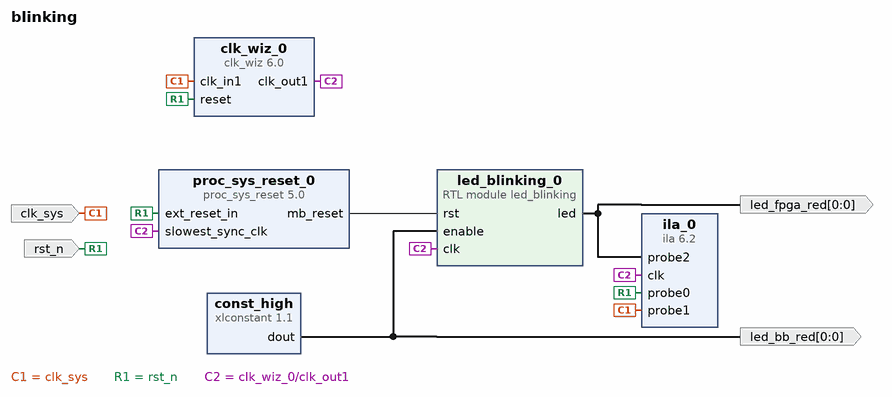
[diagram p0: block diagram of the top level]
# Vivado block design blinking, xc7a35tcsg325-2L, Vivado 2019.2.1
create_bd_design blinking

create_bd_port -dir I -type rst rst_n
set_property -dict {CONFIG.POLARITY ACTIVE_HIGH} [get_bd_ports rst_n]
create_bd_port -dir I -type clk clk_sys
set_property -dict {CONFIG.FREQ_HZ 25000000} [get_bd_ports clk_sys]
create_bd_port -dir O -from 0 -to 0 led_fpga_red
create_bd_port -dir O -from 0 -to 0 led_bb_red

create_bd_cell -type module -reference led_blinking led_blinking_0
create_bd_cell -type ip -vlnv xilinx.com:ip:clk_wiz:6.0 clk_wiz_0
set_property -dict [list \
  CONFIG.CLKIN1_JITTER_PS 400.0 \
  CONFIG.CLKOUT1_JITTER 220.126 \
  CONFIG.CLKOUT1_PHASE_ERROR 237.727 \
  CONFIG.CLKOUT1_REQUESTED_OUT_FREQ 125.000 \
  CONFIG.MMCM_CLKFBOUT_MULT_F 40.000 \
  CONFIG.MMCM_CLKIN1_PERIOD 40.000 \
  CONFIG.MMCM_CLKIN2_PERIOD 10.0 \
  CONFIG.MMCM_CLKOUT0_DIVIDE_F 8.000 \
  CONFIG.PRIM_IN_FREQ 25.0 \
] [get_bd_cells clk_wiz_0]
create_bd_cell -type ip -vlnv xilinx.com:ip:xlconstant:1.1 const_high
create_bd_cell -type ip -vlnv xilinx.com:ip:proc_sys_reset:5.0 proc_sys_reset_0
create_bd_cell -type ip -vlnv xilinx.com:ip:ila:6.2 ila_0
set_property -dict [list \
  CONFIG.C_ADV_TRIGGER true \
  CONFIG.C_DATA_DEPTH 65536 \
  CONFIG.C_ENABLE_ILA_AXI_MON false \
  CONFIG.C_MONITOR_TYPE Native \
  CONFIG.C_NUM_OF_PROBES 3 \
] [get_bd_cells ila_0]

# ---- connections ----

connect_bd_net -net clk_in1_0_1 [get_bd_ports clk_sys] [get_bd_pins clk_wiz_0/clk_in1] [get_bd_pins ila_0/probe1]
connect_bd_net [get_bd_pins led_blinking_0/led] [get_bd_ports led_fpga_red] [get_bd_pins ila_0/probe2]
connect_bd_net [get_bd_pins const_high/dout] [get_bd_ports led_bb_red] [get_bd_pins led_blinking_0/enable]
connect_bd_net [get_bd_ports rst_n] [get_bd_pins proc_sys_reset_0/ext_reset_in] [get_bd_pins clk_wiz_0/reset] [get_bd_pins ila_0/probe0]
connect_bd_net [get_bd_pins proc_sys_reset_0/mb_reset] [get_bd_pins led_blinking_0/rst]
connect_bd_net [get_bd_pins clk_wiz_0/clk_out1] \
  [get_bd_pins ila_0/clk] [get_bd_pins led_blinking_0/clk] [get_bd_pins proc_sys_reset_0/slowest_sync_clk]

validate_bd_design
save_bd_design
